# Altium schematic sheet NTC Sense V0.1.SchDoc
size A4; SheetNumber: 7; SheetTotal: 9
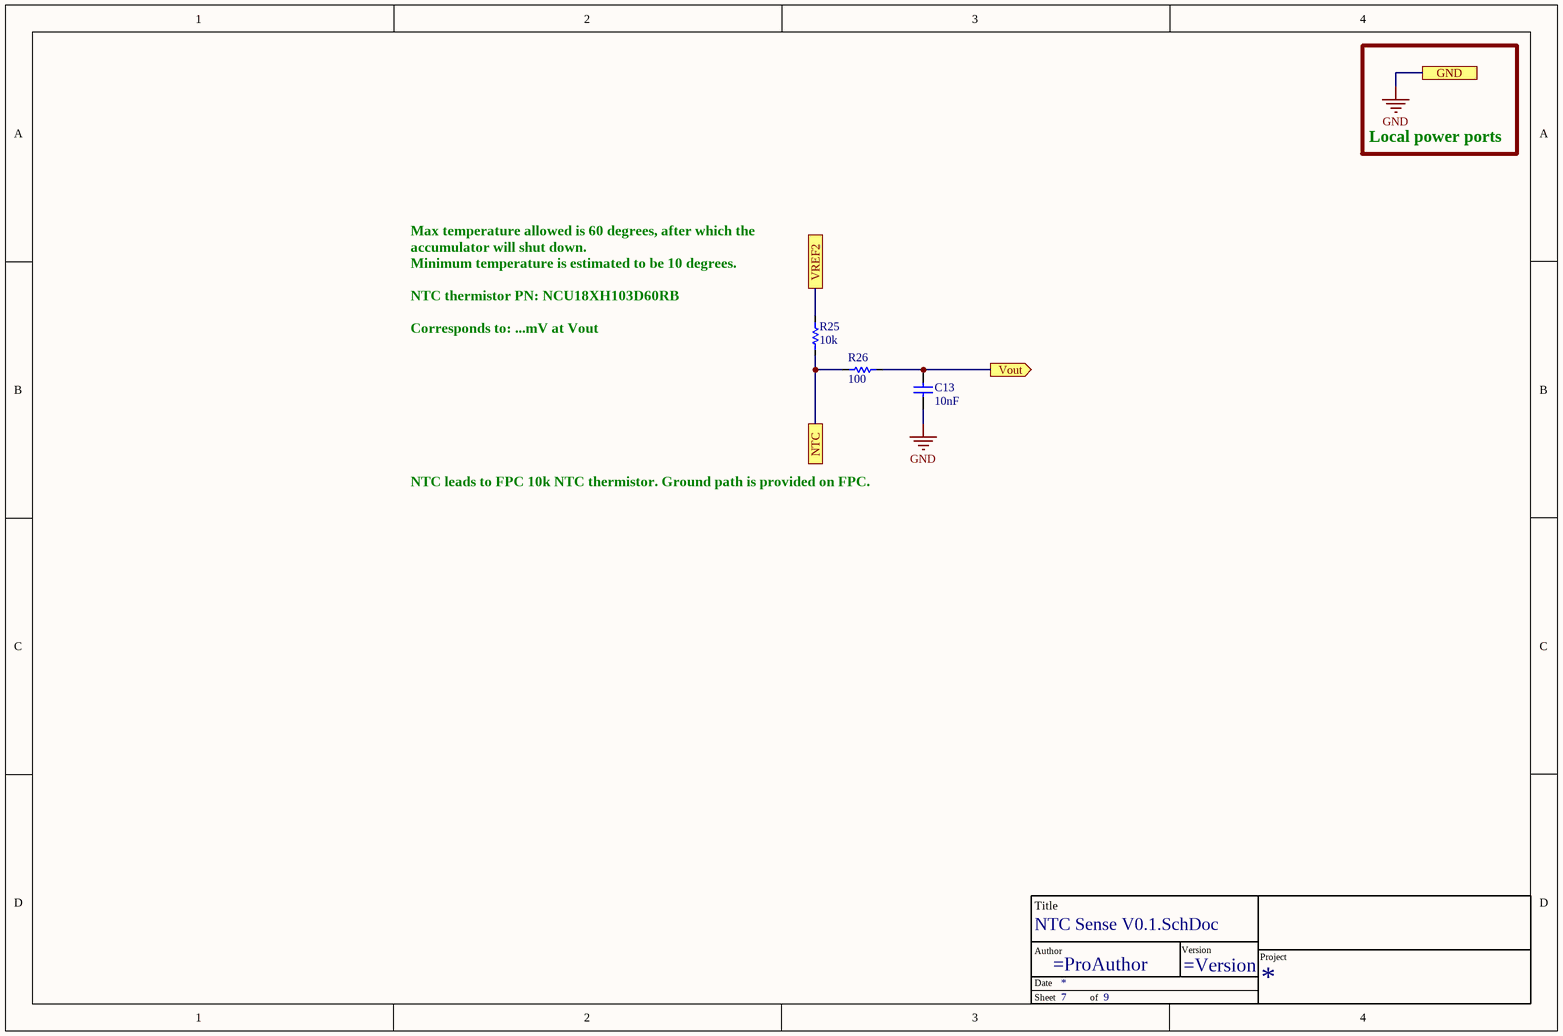
[diagram p0: NTC Sense V0.1.SchDoc]

## Parts
*  TitleBlock  (value not drawn)  (graphical)
C13  value 10nF  [C_0402]  (hidden comment: C1005X7S2A103K050BB)
R25  value 10k  [R_0402]  (hidden comment: RC0402FR-1310KL)
R26  value 100  [R_0402]  (hidden comment: RC0402FR-07100RL)

## Ports
GND, NTC, Vout (out), VREF2

## Nets
GND: C13.1 ; port GND
NTC: R25.1 R26.2 ; port NTC
Vout: C13.2 R26.1 ; port Vout
VREF2: R25.2 ; port VREF2

## Notes on the sheet
- Local power ports
- Max temperature allowed is 60 degrees, after which the accumulator will shut down.
  Minimum temperature is estimated to be 10 degrees.
  NTC thermistor PN: NCU18XH103D60RB
  Corresponds to: ...mV at Vout
- NTC leads to FPC 10k NTC thermistor. Ground path is provided on FPC.
- (in symbol TitleBlock) Title; Author; Version; Project; Date; Sheet; of

## Library data of the parts
C13 = Capacitor: ComponentLink1Description: New link; ComponentLink1URL: *
R25 R26 = Resistor